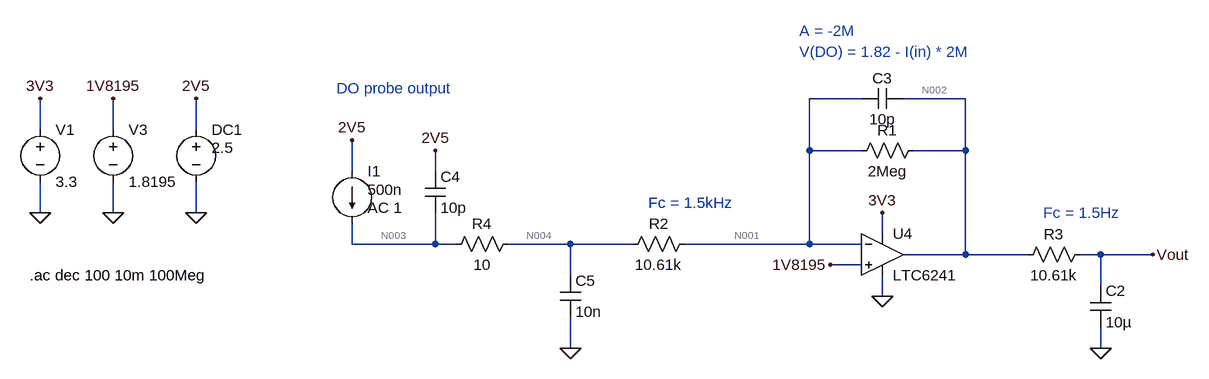
[diagram p0: schematic ltspice_opamp_2xrc.asc]
ltspice_opamp_2xrc.asc, the LTspice schematic file:
Version 4
SHEET 1 2248 680
WIRE 96 -32 16 -32
WIRE 256 -32 160 -32
WIRE -1168 16 -1168 -32
WIRE -1056 16 -1056 -32
WIRE -928 16 -928 -32
WIRE 16 48 16 -32
WIRE 96 48 16 48
WIRE 256 48 256 -32
WIRE 256 48 176 48
WIRE -688 80 -688 32
WIRE -560 80 -560 48
WIRE -1168 144 -1168 96
WIRE -1056 144 -1056 96
WIRE -928 144 -928 96
WIRE 128 176 128 144
WIRE -688 192 -688 160
WIRE -560 192 -560 144
WIRE -560 192 -688 192
WIRE -528 192 -560 192
WIRE -352 192 -448 192
WIRE -256 192 -352 192
WIRE 16 192 16 48
WIRE 16 192 -176 192
WIRE 96 192 16 192
WIRE 256 208 256 48
WIRE 256 208 160 208
WIRE 352 208 256 208
WIRE 464 208 432 208
WIRE 544 208 464 208
WIRE 96 224 48 224
WIRE -352 240 -352 192
WIRE 464 256 464 208
WIRE 128 272 128 240
WIRE -352 352 -352 304
WIRE 464 352 464 320
FLAG 128 272 0
FLAG -1168 -32 3V3
FLAG -1168 144 0
FLAG 128 144 3V3
FLAG 464 352 0
FLAG -1056 -32 1V8195
FLAG -1056 144 0
FLAG 544 208 Vout
FLAG 48 224 1V8195
FLAG -928 -32 2V5
FLAG -928 144 0
FLAG -688 32 2V5
FLAG -560 48 2V5
FLAG -352 352 0
SYMBOL voltage -1168 0 R0
WINDOW 123 0 0 Left 0
WINDOW 39 0 0 Left 0
SYMATTR InstName V1
SYMATTR Value 3.3
SYMBOL res 192 32 R90
WINDOW 0 0 56 VBottom 2
WINDOW 3 32 56 VTop 2
SYMATTR InstName R1
SYMATTR Value 2Meg
SYMATTR SpiceLine tol=0.1 pwr=0.25
SYMBOL res -160 176 R90
WINDOW 0 0 56 VBottom 2
WINDOW 3 32 56 VTop 2
SYMATTR InstName R2
SYMATTR Value 10.61k
SYMBOL res 448 192 R90
WINDOW 0 0 56 VBottom 2
WINDOW 3 32 56 VTop 2
SYMATTR InstName R3
SYMATTR Value 10.61k
SYMATTR SpiceLine tol=1 pwr=0.25
SYMBOL cap 448 256 R0
SYMATTR InstName C2
SYMATTR Value 10µ
SYMATTR SpiceLine V=10
SYMBOL voltage -1056 0 R0
WINDOW 123 0 0 Left 0
WINDOW 39 0 0 Left 0
SYMATTR InstName V3
SYMATTR Value 1.8195
SYMBOL OpAmps\\LTC6241 128 208 R0
SYMATTR InstName U4
SYMBOL voltage -928 0 R0
WINDOW 123 24 44 Left 2
WINDOW 39 0 0 Left 0
WINDOW 3 24 44 Left 2
SYMATTR Value 2.5
SYMATTR InstName DC1
SYMBOL res -432 176 R90
WINDOW 0 0 56 VBottom 2
WINDOW 3 32 56 VTop 2
SYMATTR InstName R4
SYMATTR Value 10
SYMBOL current -688 80 R0
WINDOW 3 24 28 Left 2
WINDOW 123 24 56 Left 2
WINDOW 39 0 0 Left 0
SYMATTR Value 500n
SYMATTR Value2 AC 1
SYMATTR InstName I1
SYMBOL cap -576 80 R0
SYMATTR InstName C4
SYMATTR Value 10p
SYMATTR SpiceLine V=10
SYMBOL cap 160 -48 R90
WINDOW 0 0 32 VBottom 2
WINDOW 3 32 32 VTop 2
SYMATTR InstName C3
SYMATTR Value 10p
SYMBOL cap -368 240 R0
SYMATTR InstName C5
SYMATTR Value 10n
SYMATTR SpiceLine V=10
TEXT -232 128 Left 2 ;Fc = 1.5kHz
TEXT 376 144 Left 2 ;Fc = 1.5Hz
TEXT 0 -136 Left 2 ;A = -2M
TEXT 0 -104 Left 2 ;V(DO) = 1.82 - I(in) * 2M
TEXT -1184 240 Left 2 !.ac dec 100 10m 100Meg
TEXT -232 128 Left 2 ;Fc = 1.5kHz
TEXT -712 -48 Left 2 ;DO probe output

The netlist it stands for:
* ltspice_opamp_2xrc.asc
V1 3V3 0 3.3
R1 N002 N001 2Meg tol=0.1 pwr=0.25
R2 N001 N004 10.61k
R3 Vout N002 10.61k tol=1 pwr=0.25
C2 Vout 0 10µ V=10
V3 1V8195 0 1.8195
XU4 1V8195 N001 3V3 0 N002 LTC6241  ; pins In+ In- V+ V- OUT
V§DC1 2V5 0 2.5
R4 N004 N003 10
I1 2V5 N003 500n AC 1
C4 2V5 N003 10p V=10
C3 N002 N001 10p
C5 N004 0 10n V=10
* Fc = 1.5kHz
* Fc = 1.5Hz
* A = -2M
* V(DO) = 1.82 - I(in) * 2M
.ac dec 100 10m 100Meg
* Fc = 1.5kHz
* DO probe output
.lib LTC4.lib
.backanno
.end

* Results of the author's LTspice run, read from the files saved beside the schematic
* Operating Point, zero values left out:
*   V(3v3) = 3.3 V
*   V(n002) = 819.5 mV
*   V(n001) = 1.82 V
*   V(n004) = 1.825 V
*   V(vout) = 819.5 mV
*   V(1v8195) = 1.819 V
*   V(2v5) = 2.5 V
*   V(n003) = 1.825 V
*   I(I1) = 500 nA
*   I(R4) = -500 nA
*   I(R2) = -500 nA
*   I(R1) = -500 nA
*   I(Dc1) = -500 nA
*   I(V1) = -1.445 mA
*   Ix(u4:3) = 1.445 mA
*   Ix(u4:4) = -1.446 mA
*   Ix(u4:5) = 500 nA
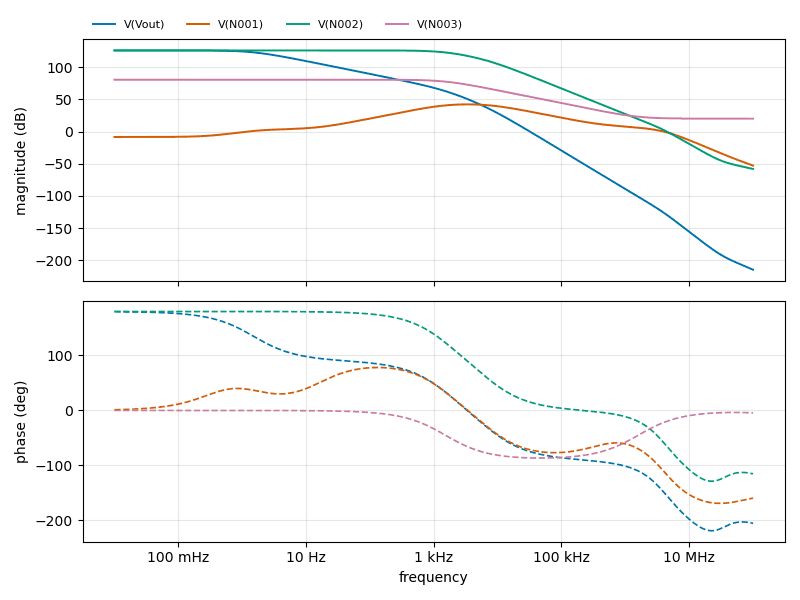
[diagram p1: AC Analysis of ltspice_opamp_2xrc.asc, plotted from the saved traces]
* AC Analysis, 1 run:
*   V(Vout): 126.02 dB at 10 mHz, -214.69 dB at 100 MHz, peak 126.02 dB at 10 mHz, 3 dB below the peak at 1.5 Hz
*   V(N001): -8.51 dB at 10 mHz, -52.88 dB at 100 MHz, peak 42.19 dB at 3.388 kHz, 3 dB below the peak at 1.135 kHz and 10.18 kHz
*   V(N002): 126.02 dB at 10 mHz, -58.21 dB at 100 MHz, peak 126.02 dB at 10 mHz, 3 dB below the peak at 1.465 kHz
*   V(N003): 80.52 dB at 10 mHz, 19.98 dB at 100 MHz, peak 80.52 dB at 5.37 Hz, 3 dB below the peak at 1.523 kHz